# Altium schematic sheet CAMAC.SchDoc
size 381 x 304 mm
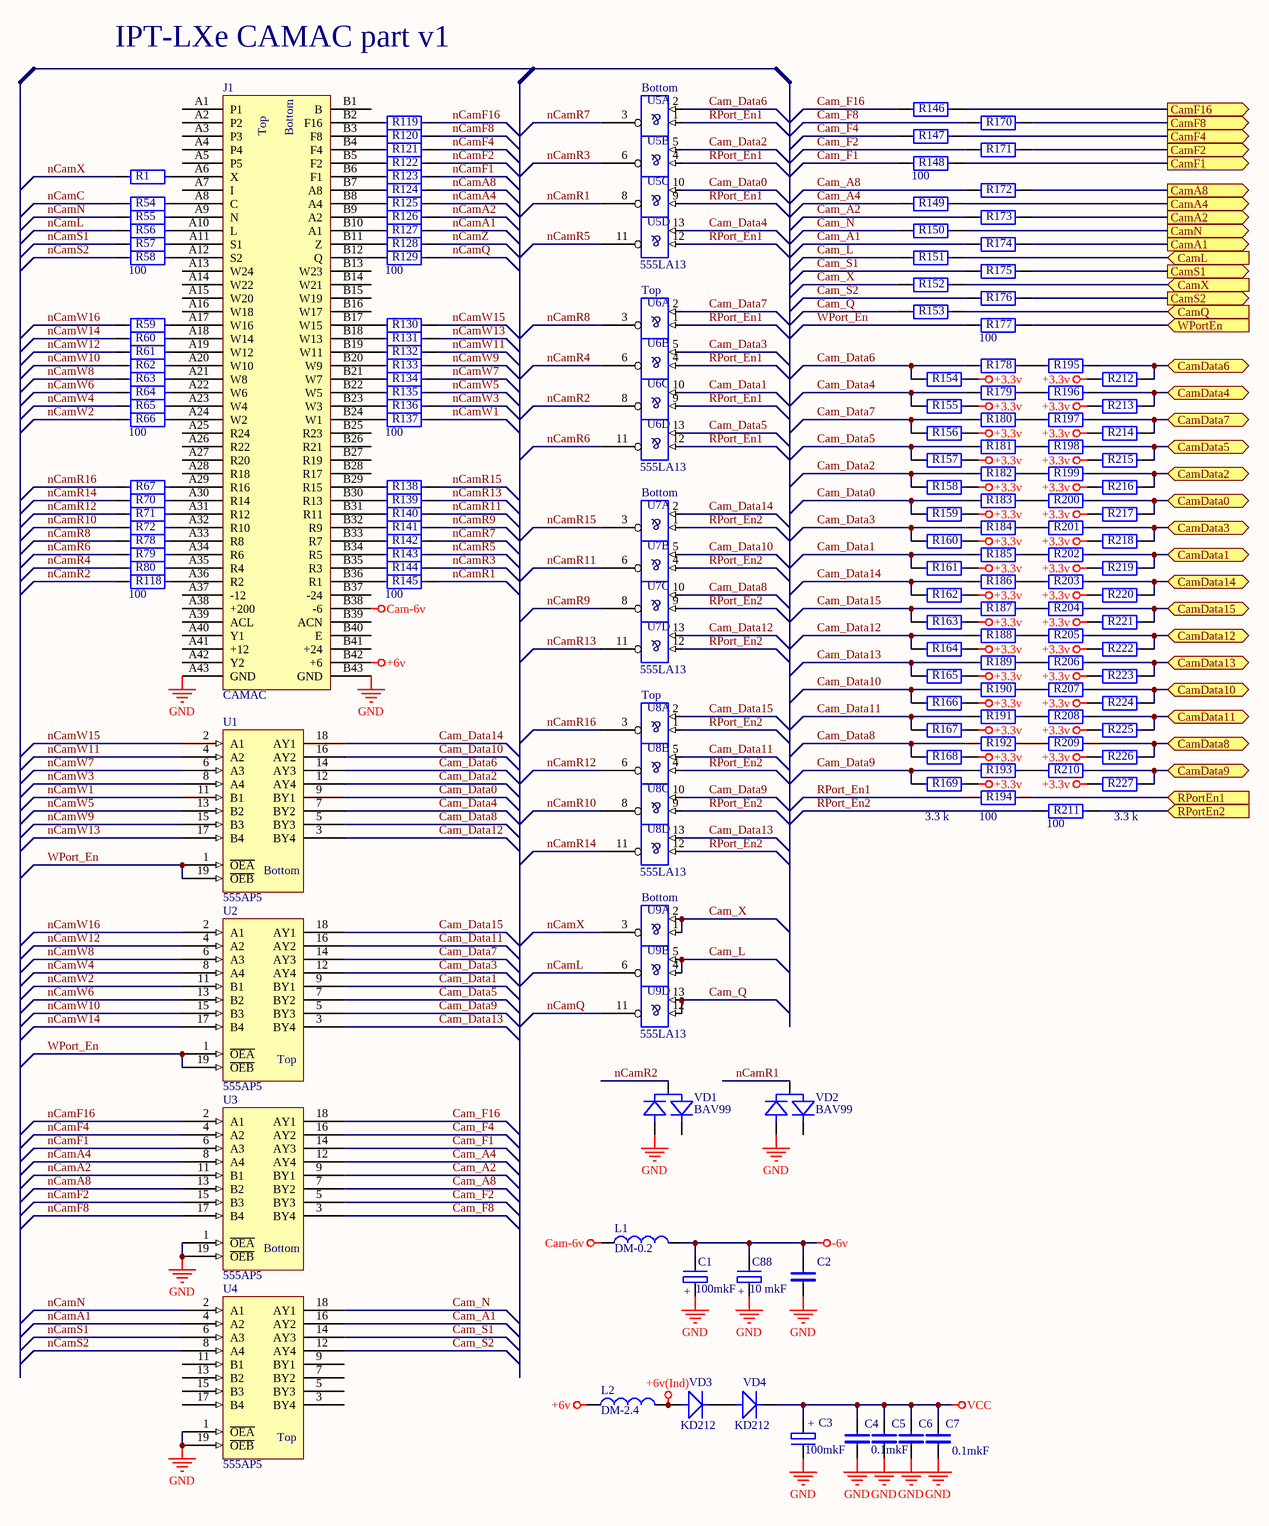
[diagram p0: CAMAC.SchDoc]

## Parts
C1  100mkF  [CP7343]
C2  0.1mkF  [chip1206]  (value not drawn)
C3  100mkF  [CP7343]
C4  0.1mkF  [chip1206]
C5  0.1mkF  [chip1206]  (value not drawn)
C6  0.1mkF  [chip1206]  (value not drawn)
C7  0.1mkF  [chip1206]
C88  10 mkF  [CP6032]
J1  CAMAC  [CAMAC]
L1  DM-0.2  [INDUCT2]
L2  DM-2.4  [INDUCT2]
R1  100  [chip0805]  (value not drawn)
R54  100  [chip0805]  (value not drawn)
R55  100  [chip0805]  (value not drawn)
R56  100  [chip0805]  (value not drawn)
R57  100  [chip0805]  (value not drawn)
R58  100  [chip0805]
R59  100  [chip0805]  (value not drawn)
R60  100  [chip0805]  (value not drawn)
R61  100  [chip0805]  (value not drawn)
R62  100  [chip0805]  (value not drawn)
R63  100  [chip0805]  (value not drawn)
R64  100  [chip0805]  (value not drawn)
R65  100  [chip0805]  (value not drawn)
R66  100  [chip0805]
R67  100  [chip0805]  (value not drawn)
R70  100  [chip0805]  (value not drawn)
R71  100  [chip0805]  (value not drawn)
R72  100  [chip0805]  (value not drawn)
R78  100  [chip0805]  (value not drawn)
R79  100  [chip0805]  (value not drawn)
R80  100  [chip0805]  (value not drawn)
R118  100  [chip0805]
R119  100  [chip0805]  (value not drawn)
R120  100  [chip0805]  (value not drawn)
R121  100  [chip0805]  (value not drawn)
R122  100  [chip0805]  (value not drawn)
R123  100  [chip0805]  (value not drawn)
R124  100  [chip0805]  (value not drawn)
R125  100  [chip0805]  (value not drawn)
R126  100  [chip0805]  (value not drawn)
R127  100  [chip0805]  (value not drawn)
R128  100  [chip0805]  (value not drawn)
R129  100  [chip0805]
R130  100  [chip0805]  (value not drawn)
R131  100  [chip0805]  (value not drawn)
R132  100  [chip0805]  (value not drawn)
R133  100  [chip0805]  (value not drawn)
R134  100  [chip0805]  (value not drawn)
R135  100  [chip0805]  (value not drawn)
R136  100  [chip0805]  (value not drawn)
R137  100  [chip0805]
R138  100  [chip0805]  (value not drawn)
R139  100  [chip0805]  (value not drawn)
R140  100  [chip0805]  (value not drawn)
R141  100  [chip0805]  (value not drawn)
R142  100  [chip0805]  (value not drawn)
R143  100  [chip0805]  (value not drawn)
R144  100  [chip0805]  (value not drawn)
R145  100  [chip0805]
R146  100  [chip0805]  (value not drawn)
R147  100  [chip0805]  (value not drawn)
R148  100  [chip0805]
R149  100  [chip0805]  (value not drawn)
R150  100  [chip0805]  (value not drawn)
R151  100  [chip0805]  (value not drawn)
R152  100  [chip0805]  (value not drawn)
R153  100  [chip0805]  (value not drawn)
R154  3.3 k  [chip0805]  (value not drawn)
R155  3.3 k  [chip0805]  (value not drawn)
R156  3.3 k  [chip0805]  (value not drawn)
R157  3.3 k  [chip0805]  (value not drawn)
R158  3.3 k  [chip0805]  (value not drawn)
R159  3.3 k  [chip0805]  (value not drawn)
R160  3.3 k  [chip0805]  (value not drawn)
R161  3.3 k  [chip0805]  (value not drawn)
R162  3.3 k  [chip0805]  (value not drawn)
R163  3.3 k  [chip0805]  (value not drawn)
R164  3.3 k  [chip0805]  (value not drawn)
R165  3.3 k  [chip0805]  (value not drawn)
R166  3.3 k  [chip0805]  (value not drawn)
R167  3.3 k  [chip0805]  (value not drawn)
R168  3.3 k  [chip0805]  (value not drawn)
R169  3.3 k  [chip0805]
R170  100  [chip0805]  (value not drawn)
R171  100  [chip0805]  (value not drawn)
R172  100  [chip0805]  (value not drawn)
R173  100  [chip0805]  (value not drawn)
R174  100  [chip0805]  (value not drawn)
R175  100  [chip0805]  (value not drawn)
R176  100  [chip0805]  (value not drawn)
R177  100  [chip0805]
R178  51  [chip0805]  (value not drawn)
R179  51  [chip0805]  (value not drawn)
R180  51  [chip0805]  (value not drawn)
R181  51  [chip0805]  (value not drawn)
R182  51  [chip0805]  (value not drawn)
R183  51  [chip0805]  (value not drawn)
R184  51  [chip0805]  (value not drawn)
R185  51  [chip0805]  (value not drawn)
R186  51  [chip0805]  (value not drawn)
R187  51  [chip0805]  (value not drawn)
R188  51  [chip0805]  (value not drawn)
R189  51  [chip0805]  (value not drawn)
R190  51  [chip0805]  (value not drawn)
R191  51  [chip0805]  (value not drawn)
R192  51  [chip0805]  (value not drawn)
R193  51  [chip0805]  (value not drawn)
R194  100  [chip0805]
R195  51  [chip0805]  (value not drawn)
R196  51  [chip0805]  (value not drawn)
R197  51  [chip0805]  (value not drawn)
R198  51  [chip0805]  (value not drawn)
R199  51  [chip0805]  (value not drawn)
R200  51  [chip0805]  (value not drawn)
R201  51  [chip0805]  (value not drawn)
R202  51  [chip0805]  (value not drawn)
R203  51  [chip0805]  (value not drawn)
R204  51  [chip0805]  (value not drawn)
R205  51  [chip0805]  (value not drawn)
R206  51  [chip0805]  (value not drawn)
R207  51  [chip0805]  (value not drawn)
R208  51  [chip0805]  (value not drawn)
R209  51  [chip0805]  (value not drawn)
R210  51  [chip0805]  (value not drawn)
R211  100  [chip0805]
R212  3.3 k  [chip0805]  (value not drawn)
R213  3.3 k  [chip0805]  (value not drawn)
R214  3.3 k  [chip0805]  (value not drawn)
R215  3.3 k  [chip0805]  (value not drawn)
R216  3.3 k  [chip0805]  (value not drawn)
R217  3.3 k  [chip0805]  (value not drawn)
R218  3.3 k  [chip0805]  (value not drawn)
R219  3.3 k  [chip0805]  (value not drawn)
R220  3.3 k  [chip0805]  (value not drawn)
R221  3.3 k  [chip0805]  (value not drawn)
R222  3.3 k  [chip0805]  (value not drawn)
R223  3.3 k  [chip0805]  (value not drawn)
R224  3.3 k  [chip0805]  (value not drawn)
R225  3.3 k  [chip0805]  (value not drawn)
R226  3.3 k  [chip0805]  (value not drawn)
R227  3.3 k  [chip0805]
U1  555AP5
U2  555AP5
U3  555AP5
U4  555AP5
U5  555LA13  [14DIP300]  (value not drawn)  (parts A,B,C,D of 4)
U6  555LA13  [14DIP300]  (value not drawn)  (parts A,B,C,D of 4)
U7  555LA13  [14DIP300]  (value not drawn)  (parts A,B,C,D of 4)
U8  555LA13  [14DIP300]  (value not drawn)  (parts A,B,C,D of 4)
U9  555LA13  [14DIP300]  (value not drawn)  (parts A,B,D of 4)
VD1  BAV99  [SOT-23]
VD2  BAV99  [SOT-23]
VD3  KD212  [DIODE6]
VD4  KD212  [DIODE6]

## Ports
CamA1 (out), CamA2 (out), CamA4 (out), CamA8 (out), CamData0 (bidir), CamData1 (bidir), CamData2 (bidir), CamData3 (bidir), CamData4 (bidir), CamData5 (bidir), CamData6 (bidir), CamData7 (bidir), CamData8 (bidir), CamData9 (bidir), CamData10 (bidir), CamData11 (bidir), CamData12 (bidir), CamData13 (bidir), CamData14 (bidir), CamData15 (bidir), CamF1 (out), CamF2 (out), CamF4 (out), CamF8 (out), CamF16 (out), CamL (in), CamN (out), CamQ (in), CamS1 (out), CamS2 (out), CamX (in), RPortEn1 (in), RPortEn2 (in), WPortEn (in)

## Nets
+3.3v: R154.2 R155.2 R156.2 R157.2 R158.2 R159.2 R160.2 R161.2 R162.2 R163.2 R164.2 R165.2 R166.2 R167.2 R168.2 R169.2 R212.1 R213.1 R214.1 R215.1 R216.1 R217.1 R218.1 R219.1 R220.1 R221.1 R222.1 R223.1 R224.1 R225.1 R226.1 R227.1
+5V: U1.20(+5V) U2.20(+5V) U3.20(+5V) U4.20(+5V)
+6v: J1.B42(+6) L2.1
+6v(Ind): L2.2 VD3.ANOD
-6v: C1.- C2.1 C88.- L1.2
Cam-6v: J1.B38(-6) L1.1
GND: C1.+ C2.2 C3.- C4.2 C5.2 C6.2 C7.2 C88.+ J1.A43(GND) J1.B43(GND) U1.10(GND) U2.10(GND) U3.1(~{OEA}) U3.10(GND) U3.19(~{OEB}) U4.1(~{OEA}) U4.10(GND) U4.19(~{OEB}) VD1.1 VD2.1
VCC: C3.+ C4.1 C5.1 C6.1 C7.1 VD4.CATH
Cam_A1: R174.1 U4.16(AY2)
Cam_A2: R173.1 U3.9(BY1)
Cam_A4: R149.1 U3.12(AY4)
Cam_A8: R172.1 U3.7(BY2)
Cam_Data0: R159.1 R183.1 U1.9(BY1) U5.10(I1)
Cam_Data1: R161.1 R185.1 U2.9(BY1) U6.10(I1)
Cam_Data2: R158.1 R182.1 U1.12(AY4) U5.5(I1)
Cam_Data3: R160.1 R184.1 U2.12(AY4) U6.5(I1)
Cam_Data4: R155.1 R179.1 U1.7(BY2) U5.13(I1)
Cam_Data5: R157.1 R181.1 U2.7(BY2) U6.13(I1)
Cam_Data6: R154.1 R178.1 U1.14(AY3) U5.2(I1)
Cam_Data7: R156.1 R180.1 U2.14(AY3) U6.2(I1)
Cam_Data8: R168.1 R192.1 U1.5(BY3) U7.10(I1)
Cam_Data9: R169.1 R193.1 U2.5(BY3) U8.10(I1)
Cam_Data10: R166.1 R190.1 U1.16(AY2) U7.5(I1)
Cam_Data11: R167.1 R191.1 U2.16(AY2) U8.5(I1)
Cam_Data12: R164.1 R188.1 U1.3(BY4) U7.13(I1)
Cam_Data13: R165.1 R189.1 U2.3(BY4) U8.13(I1)
Cam_Data14: R162.1 R186.1 U1.18(AY1) U7.2(I1)
Cam_Data15: R163.1 R187.1 U2.18(AY1) U8.2(I1)
Cam_F1: R148.1 U3.14(AY3)
Cam_F2: R171.1 U3.5(BY3)
Cam_F4: R147.1 U3.16(AY2)
Cam_F8: R170.1 U3.3(BY4)
Cam_F16: R146.1 U3.18(AY1)
Cam_L: R151.1 U9.4(I0) U9.5(I1)
Cam_N: R150.1 U4.18(AY1)
Cam_Q: R153.1 U9.12(I0) U9.13(I1)
Cam_S1: R175.1 U4.14(AY3)
Cam_S2: R176.1 U4.12(AY4)
Cam_X: R152.1 U9.1(I0) U9.2(I1)
CamA1: R174.2 ; port CamA1
CamA2: R173.2 ; port CamA2
CamA4: R149.2 ; port CamA4
CamA8: R172.2 ; port CamA8
CamData0: R200.2 R217.2 ; port CamData0
CamData1: R202.2 R219.2 ; port CamData1
CamData2: R199.2 R216.2 ; port CamData2
CamData3: R201.2 R218.2 ; port CamData3
CamData4: R196.2 R213.2 ; port CamData4
CamData5: R198.2 R215.2 ; port CamData5
CamData6: R195.2 R212.2 ; port CamData6
CamData7: R197.2 R214.2 ; port CamData7
CamData8: R209.2 R226.2 ; port CamData8
CamData9: R210.2 R227.2 ; port CamData9
CamData10: R207.2 R224.2 ; port CamData10
CamData11: R208.2 R225.2 ; port CamData11
CamData12: R205.2 R222.2 ; port CamData12
CamData13: R206.2 R223.2 ; port CamData13
CamData14: R203.2 R220.2 ; port CamData14
CamData15: R204.2 R221.2 ; port CamData15
CamF1: R148.2 ; port CamF1
CamF2: R171.2 ; port CamF2
CamF4: R147.2 ; port CamF4
CamF8: R170.2 ; port CamF8
CamF16: R146.2 ; port CamF16
CamL: R151.2 ; port CamL
CamN: R150.2 ; port CamN
CamQ: R153.2 ; port CamQ
CamS1: R175.2 ; port CamS1
CamS2: R176.2 ; port CamS2
CamX: R152.2 ; port CamX
nCamA1: R127.2 U4.4(A2)
nCamA2: R126.2 U3.11(B1)
nCamA4: R125.2 U3.8(A4)
nCamA8: R124.2 U3.13(B2)
nCamC: R54.1
nCamF1: R123.2 U3.6(A3)
nCamF2: R122.2 U3.15(B3)
nCamF4: R121.2 U3.4(A2)
nCamF8: R120.2 U3.17(B4)
nCamF16: R119.2 U3.2(A1)
nCamL: R56.1 U9.6(~{O})
nCamN: R55.1 U4.2(A1)
nCamQ: R129.2 U9.11(~{O})
nCamR1: R145.2 U5.8(~{O}) VD2.3
nCamR2: R118.1 U6.8(~{O}) VD1.3
nCamR3: R144.2 U5.6(~{O})
nCamR4: R80.1 U6.6(~{O})
nCamR5: R143.2 U5.11(~{O})
nCamR6: R79.1 U6.11(~{O})
nCamR7: R142.2 U5.3(~{O})
nCamR8: R78.1 U6.3(~{O})
nCamR9: R141.2 U7.8(~{O})
nCamR10: R72.1 U8.8(~{O})
nCamR11: R140.2 U7.6(~{O})
nCamR12: R71.1 U8.6(~{O})
nCamR13: R139.2 U7.11(~{O})
nCamR14: R70.1 U8.11(~{O})
nCamR15: R138.2 U7.3(~{O})
nCamR16: R67.1 U8.3(~{O})
nCamS1: R57.1 U4.6(A3)
nCamS2: R58.1 U4.8(A4)
nCamW1: R137.2 U1.11(B1)
nCamW2: R66.1 U2.11(B1)
nCamW3: R136.2 U1.8(A4)
nCamW4: R65.1 U2.8(A4)
nCamW5: R135.2 U1.13(B2)
nCamW6: R64.1 U2.13(B2)
nCamW7: R134.2 U1.6(A3)
nCamW8: R63.1 U2.6(A3)
nCamW9: R133.2 U1.15(B3)
nCamW10: R62.1 U2.15(B3)
nCamW11: R132.2 U1.4(A2)
nCamW12: R61.1 U2.4(A2)
nCamW13: R131.2 U1.17(B4)
nCamW14: R60.1 U2.17(B4)
nCamW15: R130.2 U1.2(A1)
nCamW16: R59.1 U2.2(A1)
nCamX: R1.1 U9.3(~{O})
nCamZ: R128.2
RPort_En1: R194.1 U5.1(I0) U5.4(I0) U5.9(I0) U5.12(I0) U6.1(I0) U6.4(I0) U6.9(I0) U6.12(I0)
RPort_En2: R211.1 U7.1(I0) U7.4(I0) U7.9(I0) U7.12(I0) U8.1(I0) U8.4(I0) U8.9(I0) U8.12(I0)
RPortEn1: R194.2 ; port RPortEn1
RPortEn2: R211.2 ; port RPortEn2
WPort_En: R177.1 U1.1(~{OEA}) U1.19(~{OEB}) U2.1(~{OEA}) U2.19(~{OEB})
WPortEn: R177.2 ; port WPortEn
NetJ1_A6: J1.A6(X) R1.2
NetJ1_A8: J1.A8(C) R54.2
NetJ1_A9: J1.A9(N) R55.2
NetJ1_A10: J1.A10(L) R56.2
NetJ1_A11: J1.A11(S1) R57.2
NetJ1_A12: J1.A12(S2) R58.2
NetJ1_A17: J1.A17(W16) R59.2
NetJ1_A18: J1.A18(W14) R60.2
NetJ1_A19: J1.A19(W12) R61.2
NetJ1_A20: J1.A20(W10) R62.2
NetJ1_A21: J1.A21(W8) R63.2
NetJ1_A22: J1.A22(W6) R64.2
NetJ1_A23: J1.A23(W4) R65.2
NetJ1_A24: J1.A24(W2) R66.2
NetJ1_A29: J1.A29(R16) R67.2
NetJ1_A30: J1.A30(R14) R70.2
NetJ1_A31: J1.A31(R12) R71.2
NetJ1_A32: J1.A32(R10) R72.2
NetJ1_A33: J1.A33(R8) R78.2
NetJ1_A34: J1.A34(R6) R79.2
NetJ1_A35: J1.A35(R4) R80.2
NetJ1_A36: J1.A36(R2) R118.2
NetJ1_B2: J1.B2(F16) R119.1
NetJ1_B3: J1.B3(F8) R120.1
NetJ1_B4: J1.B4(F4) R121.1
NetJ1_B5: J1.B5(F2) R122.1
NetJ1_B6: J1.B6(F1) R123.1
NetJ1_B7: J1.B7(A8) R124.1
NetJ1_B8: J1.B8(A4) R125.1
NetJ1_B9: J1.B9(A2) R126.1
NetJ1_B10: J1.B10(A1) R127.1
NetJ1_B11: J1.B11(Z) R128.1
NetJ1_B12: J1.B12(Q) R129.1
NetJ1_B17: J1.B17(W15) R130.1
NetJ1_B18: J1.B18(W13) R131.1
NetJ1_B19: J1.B19(W11) R132.1
NetJ1_B20: J1.B20(W9) R133.1
NetJ1_B21: J1.B21(W7) R134.1
NetJ1_B22: J1.B22(W5) R135.1
NetJ1_B23: J1.B23(W3) R136.1
NetJ1_B24: J1.B24(W1) R137.1
NetJ1_B29: J1.B29(R15) R138.1
NetJ1_B30: J1.B30(R13) R139.1
NetJ1_B31: J1.B31(R11) R140.1
NetJ1_B32: J1.B32(R9) R141.1
NetJ1_B33: J1.B33(R7) R142.1
NetJ1_B34: J1.B34(R5) R143.1
NetJ1_B35: J1.B35(R3) R144.1
NetJ1_B36: J1.B36(R1) R145.1
NetR178_2: R178.2 R195.1
NetR179_2: R179.2 R196.1
NetR180_2: R180.2 R197.1
NetR181_2: R181.2 R198.1
NetR182_2: R182.2 R199.1
NetR183_2: R183.2 R200.1
NetR184_2: R184.2 R201.1
NetR185_2: R185.2 R202.1
NetR186_2: R186.2 R203.1
NetR187_2: R187.2 R204.1
NetR188_2: R188.2 R205.1
NetR189_2: R189.2 R206.1
NetR190_2: R190.2 R207.1
NetR191_2: R191.2 R208.1
NetR192_2: R192.2 R209.1
NetR193_2: R193.2 R210.1
NetVD3_CATH: VD3.CATH VD4.ANOD

Not connected (* = marked no-connect by the designer): J1 A1(P1) A2(P2) A3(P3) A4(P4) A5(P5) A7(I) A13(W24) A14(W22) A15(W20) A16(W18) A25(R24) A26(R22) A27(R20) A28(R18) A37(-12) A38(+200) A39(ACL) A40(Y1) A41(+12) A42(Y2) B1(B) B13(W23) B14(W21) B15(W19) B16(W17) B25(R23) B26(R21) B27(R19) B28(R17) B37(-24) B39(ACN) B40(E) B41(+24); U4 3(BY4) 5(BY3) 7(BY2) 9(BY1) 11(B1) 13(B2) 15(B3) 17(B4); VD1 2; VD2 2

## Notes on the sheet
- IPT-LXe CAMAC part v1
- (near U5) Bottom
- (near J1) Top
- (near J1) Bottom
- (near U6) Top
- (near U7) Bottom
- (near U8) Top
- (near U1) Bottom
- (near U9) Bottom
- (near U2) Top
- (near U3) Bottom
- (near U4) Top
- (in symbol 555LA13, part A) &
- (in symbol 555LA13, part B) &
- (in symbol 555LA13, part C) &
- (in symbol 555LA13, part D) &

## Library data of the parts
C1 C3 C88 = C POL
C2 C4-C7 = C
J1 = CAMACF
L1 L2 = INDUCTOR
R1 R54-R67 R70-R72 R78-R80 R118-R227 = R
U1-U4 = 555AP5: Text Field1: 60; Text Field2: 120
U5-U9 = 555LA13: Text Field1: 20; Text Field2: 30
VD1 VD2 = BAV99: Double diode
VD3 VD4 = AD110